# EAGLE design mux-board (EAGLE 8.5.1)

## Sheet 1 of 2
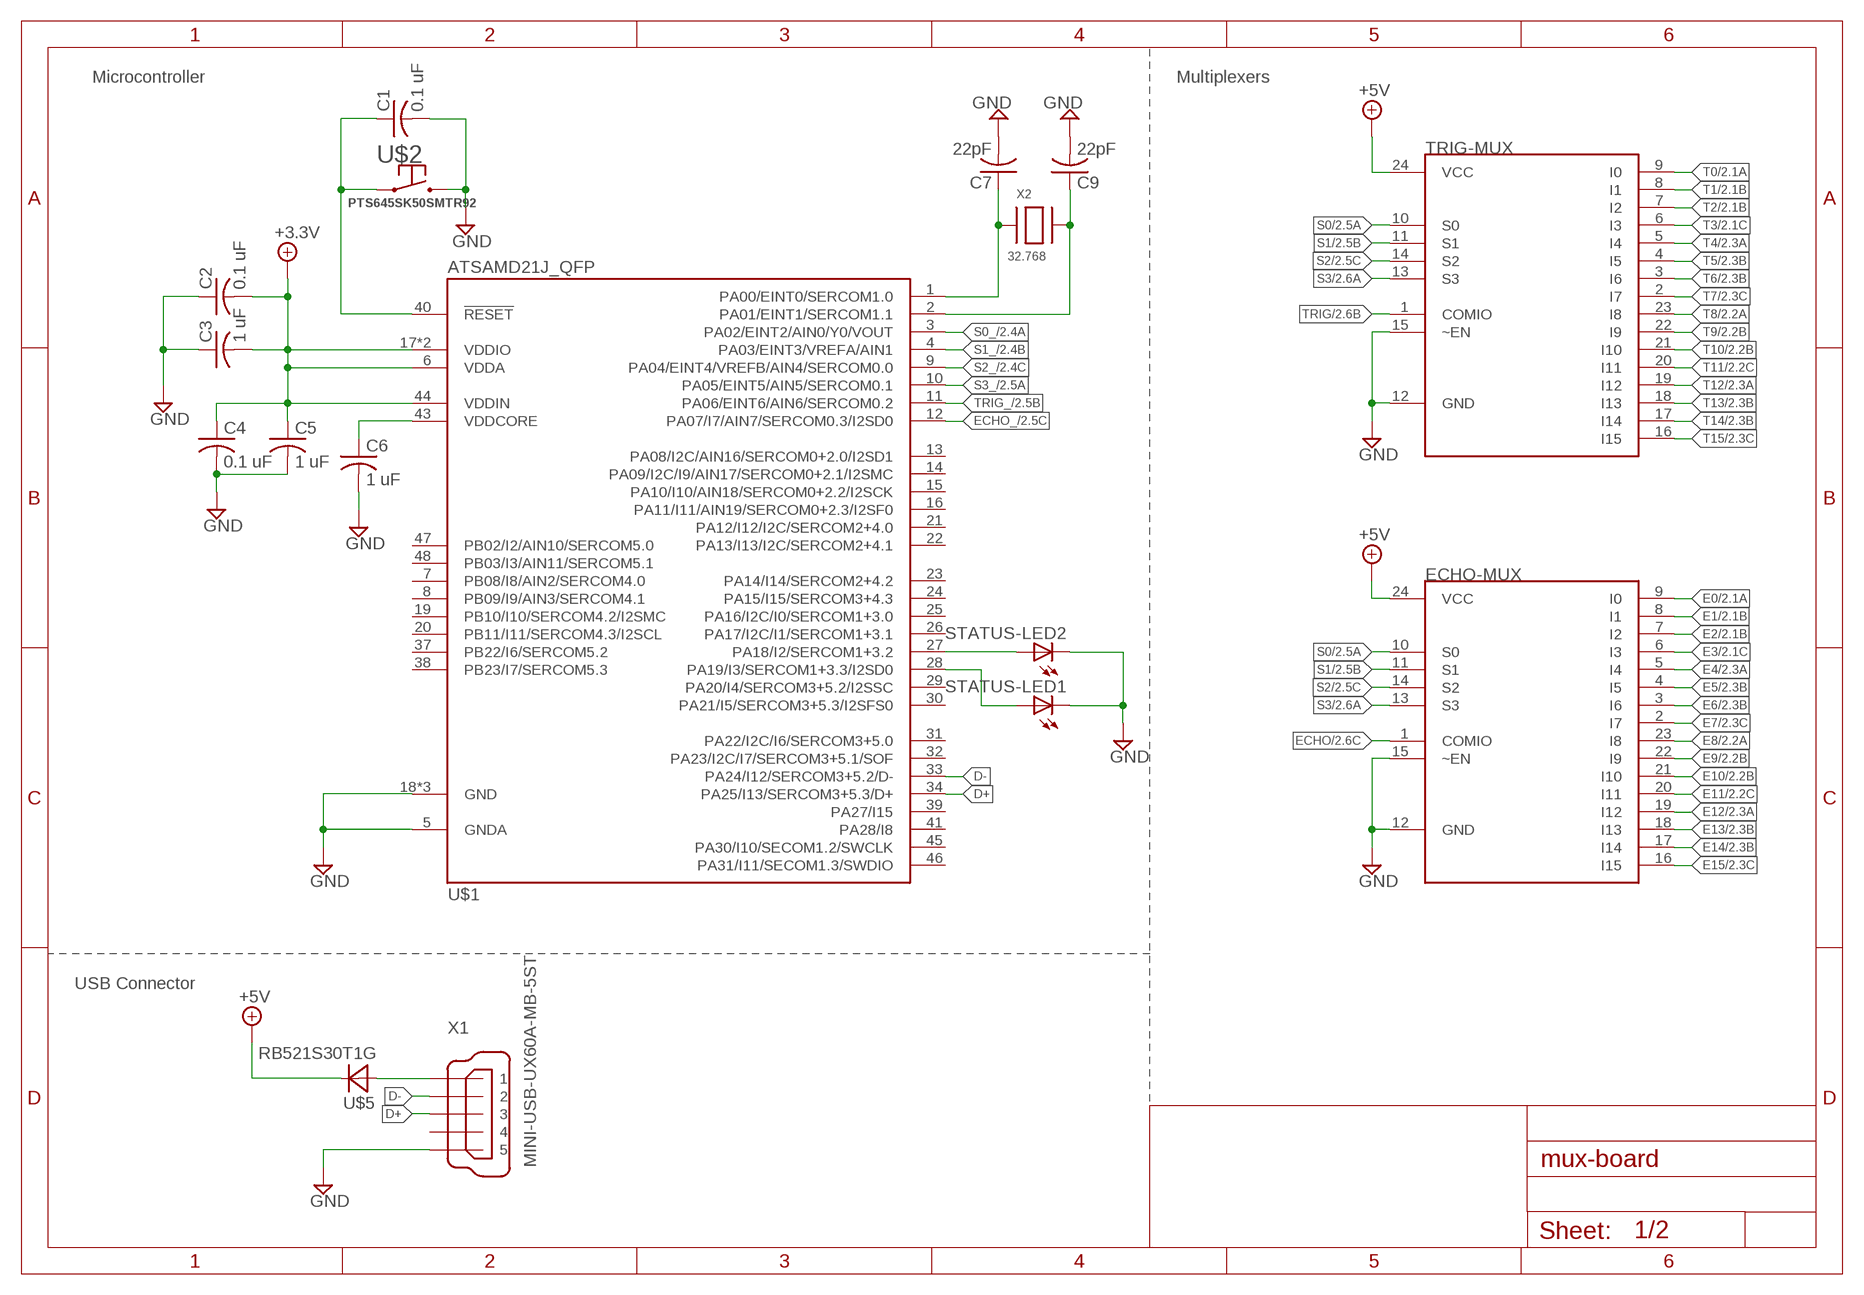
[diagram p0: schematic, sheet 1]

### Parts
C1  0.1 uF  C-USC0603  [C0603]
C2  0.1 uF  C-USC0603  [C0603]
C3  1 uF  C-USC0603  [C0603]
C4  0.1 uF  C-USC0603  [C0603]
C5  1 uF  C-USC0603  [C0603]
C6  1 uF  C-USC0603  [C0603]
C7  22pF  C-USC0603  [C0603]
C9  22pF  C-USC0603  [C0603]
ECHO-MUX  CD74HC4067  [SO24R]
STATUS-LED1  LEDSML0603  [SML0603]
STATUS-LED2  LEDSML0603  [SML0603]
TRIG-MUX  CD74HC4067  [SO24R]
U$1  ATSAMD21J_QFP  [TQFP48_7MM]
U$2  PTS645SK50SMTR92  [PTS645SK50SMTR92]
U$5  RB521S30T1G  [SOD523]
X1  MINI-USB-UX60A-MB-5ST  [UX60A-MB-5ST]
X2  32.768  XTAL-3.2X1.5  [XTAL3215]

### Nets
+3.3V: C2.2 C3.2 C4.1 C5.1 U$1.6(VDDA) U$1.17(VDDIO) U$1.36(VDDIO) U$1.44(VDDIN) ; also sheet 2
+5V: ECHO-MUX.24(VCC) TRIG-MUX.24(VCC) U$5.C ; also sheet 2
D+: U$1.34(PA25/I13/SERCOM3+5.3/D+) X1.3
D-: U$1.33(PA24/I12/SERCOM3+5.2/D-) X1.2
E0: ECHO-MUX.9(I0) ; also sheet 2
E1: ECHO-MUX.8(I1) ; also sheet 2
E2: ECHO-MUX.7(I2) ; also sheet 2
E3: ECHO-MUX.6(I3) ; also sheet 2
E4: ECHO-MUX.5(I4) ; also sheet 2
E5: ECHO-MUX.4(I5) ; also sheet 2
E6: ECHO-MUX.3(I6) ; also sheet 2
E7: ECHO-MUX.2(I7) ; also sheet 2
E8: ECHO-MUX.23(I8) ; also sheet 2
E9: ECHO-MUX.22(I9) ; also sheet 2
E10: ECHO-MUX.21(I10) ; also sheet 2
E11: ECHO-MUX.20(I11) ; also sheet 2
E12: ECHO-MUX.19(I12) ; also sheet 2
E13: ECHO-MUX.18(I13) ; also sheet 2
E14: ECHO-MUX.17(I14) ; also sheet 2
E15: ECHO-MUX.16(I15) ; also sheet 2
ECHO: ECHO-MUX.1(COMIO) ; also sheet 2
ECHO_: U$1.12(PA07/I7/AIN7/SERCOM0.3/I2SD0) ; also sheet 2
GND: C1.2 C2.1 C3.1 C4.2 C5.2 C6.2 C7.2 C9.2 ECHO-MUX.12(GND) ECHO-MUX.15(~EN) STATUS-LED1.C STATUS-LED2.C TRIG-MUX.12(GND) TRIG-MUX.15(~EN) U$1.5(GNDA) U$1.18(GND) U$1.35(GND) U$1.42(GND) U$2.3 U$2.4 X1.5 ; also sheet 2
N$1: C6.1 U$1.43(VDDCORE)
N$2: C1.1 U$1.40(!RESET) U$2.1 U$2.2
N$3: STATUS-LED1.A U$1.28(PA19/I3/SERCOM1+3.3/I2SD0)
N$4: U$5.A X1.1
N$5: STATUS-LED2.A U$1.27(PA18/I2/SERCOM1+3.2)
S0: ECHO-MUX.10(S0) TRIG-MUX.10(S0) ; also sheet 2
S0_: U$1.3(PA02/EINT2/AIN0/Y0/VOUT) ; also sheet 2
S1: ECHO-MUX.11(S1) TRIG-MUX.11(S1) ; also sheet 2
S1_: U$1.4(PA03/EINT3/VREFA/AIN1) ; also sheet 2
S2: ECHO-MUX.14(S2) TRIG-MUX.14(S2) ; also sheet 2
S2_: U$1.9(PA04/EINT4/VREFB/AIN4/SERCOM0.0) ; also sheet 2
S3: ECHO-MUX.13(S3) TRIG-MUX.13(S3) ; also sheet 2
S3_: U$1.10(PA05/EINT5/AIN5/SERCOM0.1) ; also sheet 2
T0: TRIG-MUX.9(I0) ; also sheet 2
T1: TRIG-MUX.8(I1) ; also sheet 2
T2: TRIG-MUX.7(I2) ; also sheet 2
T3: TRIG-MUX.6(I3) ; also sheet 2
T4: TRIG-MUX.5(I4) ; also sheet 2
T5: TRIG-MUX.4(I5) ; also sheet 2
T6: TRIG-MUX.3(I6) ; also sheet 2
T7: TRIG-MUX.2(I7) ; also sheet 2
T8: TRIG-MUX.23(I8) ; also sheet 2
T9: TRIG-MUX.22(I9) ; also sheet 2
T10: TRIG-MUX.21(I10) ; also sheet 2
T11: TRIG-MUX.20(I11) ; also sheet 2
T12: TRIG-MUX.19(I12) ; also sheet 2
T13: TRIG-MUX.18(I13) ; also sheet 2
T14: TRIG-MUX.17(I14) ; also sheet 2
T15: TRIG-MUX.16(I15) ; also sheet 2
TRIG: TRIG-MUX.1(COMIO) ; also sheet 2
TRIG_: U$1.11(PA06/EINT6/AIN6/SERCOM0.2) ; also sheet 2
X3-1: C7.1 U$1.1(PA00/EINT0/SERCOM1.0) X2.P$1
X3-2: C9.1 U$1.2(PA01/EINT1/SERCOM1.1) X2.P$2
Unconnected: U$1.7(PB08/I8/AIN2/SERCOM4.0) U$1.8(PB09/I9/AIN3/SERCOM4.1) U$1.13(PA08/I2C/AIN16/SERCOM0+2.0/I2SD1) U$1.14(PA09/I2C/I9/AIN17/SERCOM0+2.1/I2SMC) U$1.15(PA10/I10/AIN18/SERCOM0+2.2/I2SCK) U$1.16(PA11/I11/AIN19/SERCOM0+2.3/I2SF0) U$1.19(PB10/I10/SERCOM4.2/I2SMC) U$1.20(PB11/I11/SERCOM4.3/I2SCL) U$1.21(PA12/I12/I2C/SERCOM2+4.0) U$1.22(PA13/I13/I2C/SERCOM2+4.1) U$1.23(PA14/I14/SERCOM2+4.2) U$1.24(PA15/I15/SERCOM3+4.3) U$1.25(PA16/I2C/I0/SERCOM1+3.0) U$1.26(PA17/I2C/I1/SERCOM1+3.1) U$1.29(PA20/I4/SERCOM3+5.2/I2SSC) U$1.30(PA21/I5/SERCOM3+5.3/I2SFS0) U$1.31(PA22/I2C/I6/SERCOM3+5.0) U$1.32(PA23/I2C/I7/SERCOM3+5.1/SOF) U$1.37(PB22/I6/SERCOM5.2) U$1.38(PB23/I7/SERCOM5.3) U$1.39(PA27/I15) U$1.41(PA28/I8) U$1.45(PA30/I10/SECOM1.2/SWCLK) U$1.46(PA31/I11/SECOM1.3/SWDIO) U$1.47(PB02/I2/AIN10/SERCOM5.0) U$1.48(PB03/I3/AIN11/SERCOM5.1) X1.4

### Notes on the sheet
- Microcontroller | Multiplexers
- USB Connector

## Sheet 2 of 2
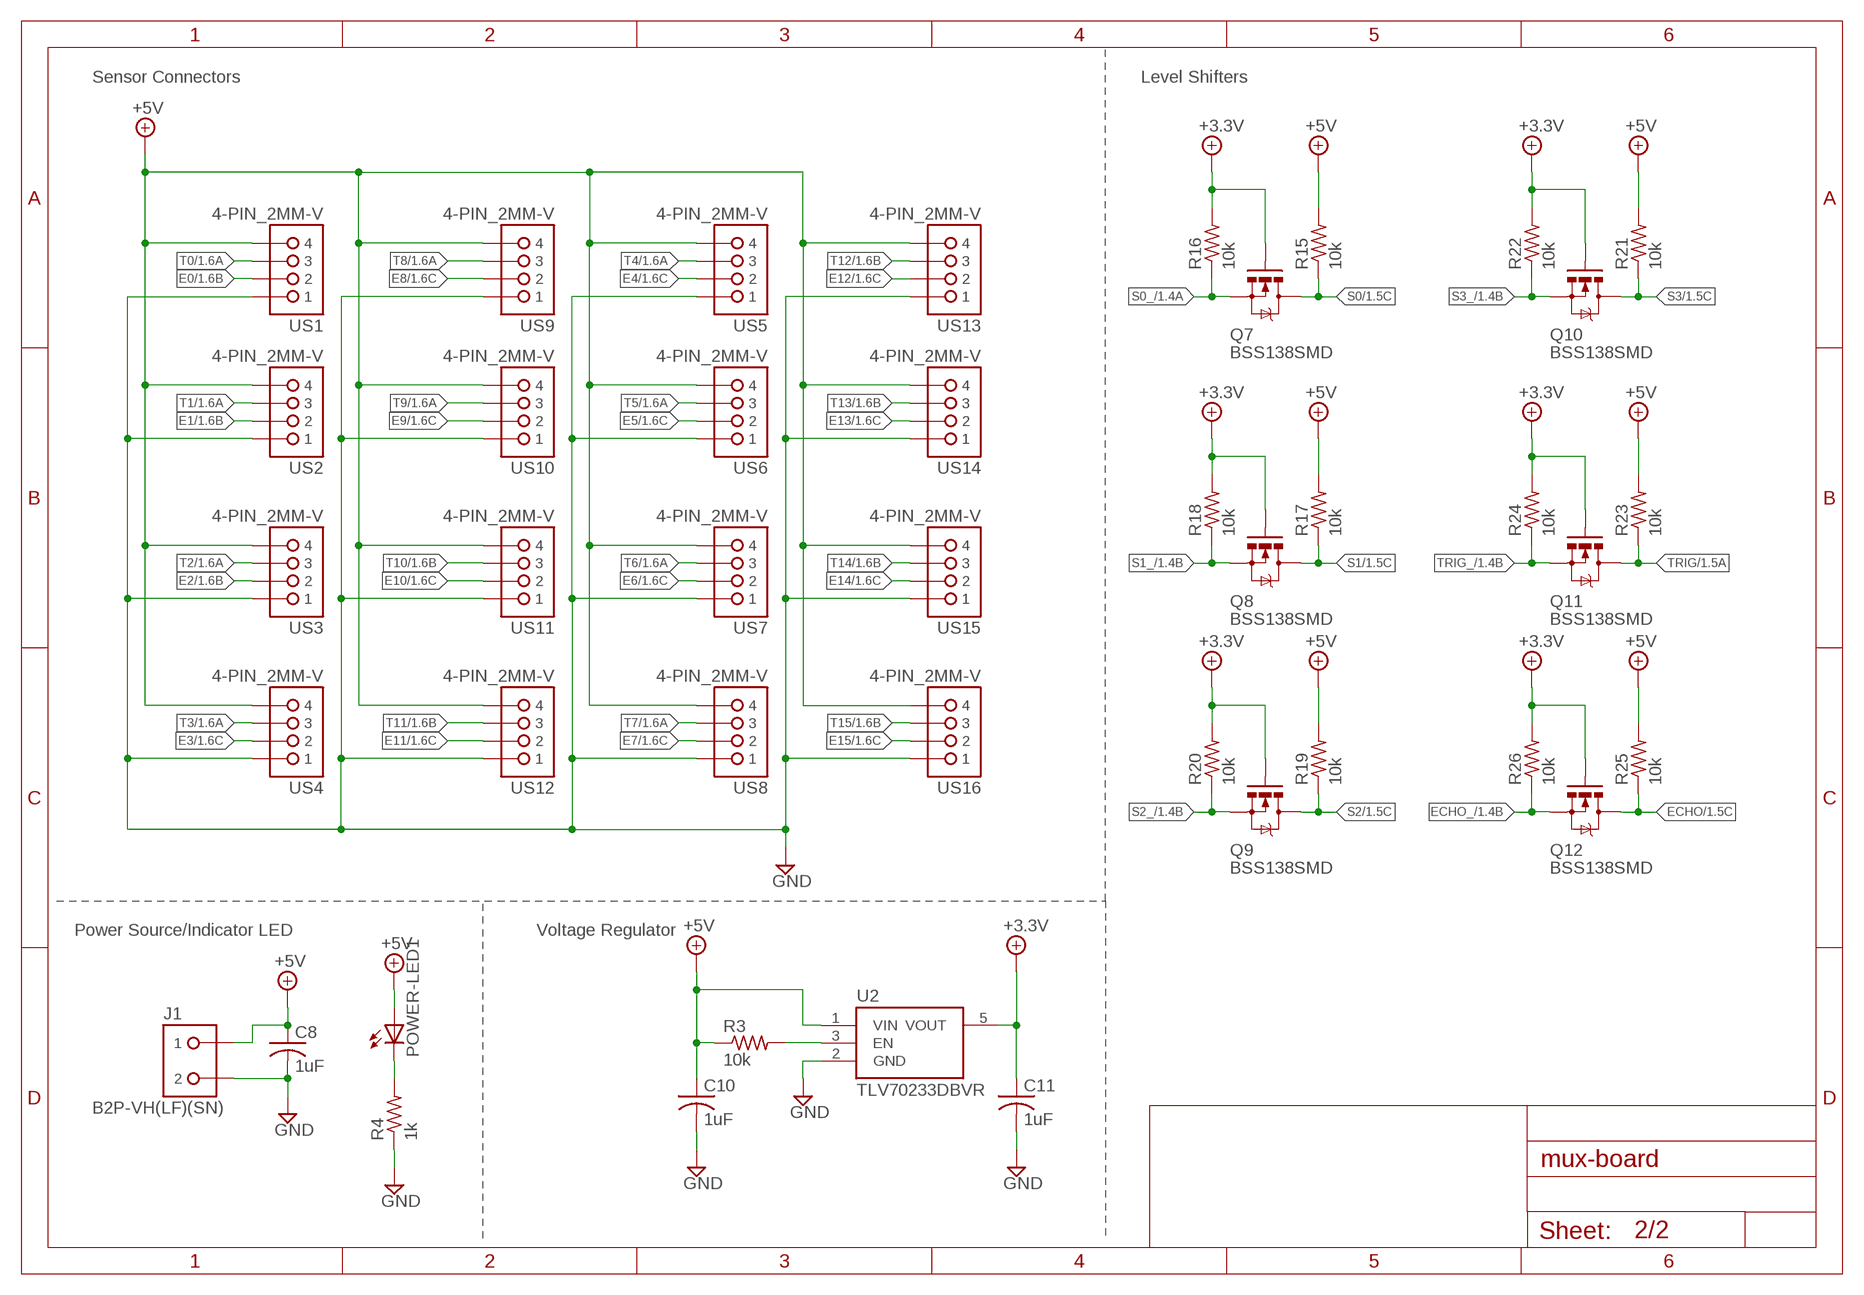
[diagram p1: schematic, sheet 2]

### Parts
C8  1uF  C-USC0603  [C0603]
C10  1uF  C-USC0603  [C0603]
C11  1uF  C-USC0603  [C0603]
J1  B2P-VH(LF)(SN)  [B2P]
POWER-LED1  LEDSML0603  [SML0603]
Q7  BSS138SMD  [SPARKFUN_SOT23-3]
Q8  BSS138SMD  [SPARKFUN_SOT23-3]
Q9  BSS138SMD  [SPARKFUN_SOT23-3]
Q10  BSS138SMD  [SPARKFUN_SOT23-3]
Q11  BSS138SMD  [SPARKFUN_SOT23-3]
Q12  BSS138SMD  [SPARKFUN_SOT23-3]
R3  10k  R-US_R0603  [R0603]
R4  1k  R-US_R0603  [R0603]
R15  10k  R-US_R0603  [R0603]
R16  10k  R-US_R0603  [R0603]
R17  10k  R-US_R0603  [R0603]
R18  10k  R-US_R0603  [R0603]
R19  10k  R-US_R0603  [R0603]
R20  10k  R-US_R0603  [R0603]
R21  10k  R-US_R0603  [R0603]
R22  10k  R-US_R0603  [R0603]
R23  10k  R-US_R0603  [R0603]
R24  10k  R-US_R0603  [R0603]
R25  10k  R-US_R0603  [R0603]
R26  10k  R-US_R0603  [R0603]
U2  TLV70233DBVR  [SOT-23-5]
US1  4-PIN_2MM-V  [2MM-4-V]
US2  4-PIN_2MM-V  [2MM-4-V]
US3  4-PIN_2MM-V  [2MM-4-V]
US4  4-PIN_2MM-V  [2MM-4-V]
US5  4-PIN_2MM-V  [2MM-4-V]
US6  4-PIN_2MM-V  [2MM-4-V]
US7  4-PIN_2MM-V  [2MM-4-V]
US8  4-PIN_2MM-V  [2MM-4-V]
US9  4-PIN_2MM-V  [2MM-4-V]
US10  4-PIN_2MM-V  [2MM-4-V]
US11  4-PIN_2MM-V  [2MM-4-V]
US12  4-PIN_2MM-V  [2MM-4-V]
US13  4-PIN_2MM-V  [2MM-4-V]
US14  4-PIN_2MM-V  [2MM-4-V]
US15  4-PIN_2MM-V  [2MM-4-V]
US16  4-PIN_2MM-V  [2MM-4-V]

### Nets
+3.3V: C11.1 Q7.1(G) Q8.1(G) Q9.1(G) Q10.1(G) Q11.1(G) Q12.1(G) R16.2 R18.2 R20.2 R22.2 R24.2 R26.2 U2.5(VOUT) ; also sheet 1
+5V: C8.1 C10.1 J1.1 POWER-LED1.A R3.1 R15.2 R17.2 R19.2 R21.2 R23.2 R25.2 U2.1(VIN) US1.4 US2.4 US3.4 US4.4 US5.4 US6.4 US7.4 US8.4 US9.4 US10.4 US11.4 US12.4 US13.4 US14.4 US15.4 US16.4 ; also sheet 1
E0: US1.2 ; also sheet 1
E1: US2.2 ; also sheet 1
E2: US3.2 ; also sheet 1
E3: US4.2 ; also sheet 1
E4: US5.2 ; also sheet 1
E5: US6.2 ; also sheet 1
E6: US7.2 ; also sheet 1
E7: US8.2 ; also sheet 1
E8: US9.2 ; also sheet 1
E9: US10.2 ; also sheet 1
E10: US11.2 ; also sheet 1
E11: US12.2 ; also sheet 1
E12: US13.2 ; also sheet 1
E13: US14.2 ; also sheet 1
E14: US15.2 ; also sheet 1
E15: US16.2 ; also sheet 1
ECHO: Q12.3(D) R25.1 ; also sheet 1
ECHO_: Q12.2(S) R26.1 ; also sheet 1
GND: C8.2 C10.2 C11.2 J1.2 R4.1 U2.2(GND) US1.1 US2.1 US3.1 US4.1 US5.1 US6.1 US7.1 US8.1 US9.1 US10.1 US11.1 US12.1 US13.1 US14.1 US15.1 US16.1 ; also sheet 1
N$10: R3.2 U2.3(EN)
N$11: POWER-LED1.C R4.2
S0: Q7.3(D) R15.1 ; also sheet 1
S0_: Q7.2(S) R16.1 ; also sheet 1
S1: Q8.3(D) R17.1 ; also sheet 1
S1_: Q8.2(S) R18.1 ; also sheet 1
S2: Q9.3(D) R19.1 ; also sheet 1
S2_: Q9.2(S) R20.1 ; also sheet 1
S3: Q10.3(D) R21.1 ; also sheet 1
S3_: Q10.2(S) R22.1 ; also sheet 1
T0: US1.3 ; also sheet 1
T1: US2.3 ; also sheet 1
T2: US3.3 ; also sheet 1
T3: US4.3 ; also sheet 1
T4: US5.3 ; also sheet 1
T5: US6.3 ; also sheet 1
T6: US7.3 ; also sheet 1
T7: US8.3 ; also sheet 1
T8: US9.3 ; also sheet 1
T9: US10.3 ; also sheet 1
T10: US11.3 ; also sheet 1
T11: US12.3 ; also sheet 1
T12: US13.3 ; also sheet 1
T13: US14.3 ; also sheet 1
T14: US15.3 ; also sheet 1
T15: US16.3 ; also sheet 1
TRIG: Q11.3(D) R23.1 ; also sheet 1
TRIG_: Q11.2(S) R24.1 ; also sheet 1

### Notes on the sheet
- Sensor Connectors | Level Shifters
- Power Source/Indicator LED | Voltage Regulator

## Library data of the parts
C1-C6 = resistor:C-US: CAPACITOR, American symbol
C7-C11 = rcl:C-US: CAPACITOR, American symbol
ECHO-MUX TRIG-MUX = mux-board:CD74HC4067
J1 = RoboJackets-Connectors:B2P?-VH(LF)(SN): Power Connector Brand: JST Sales America Inc. <https://www.jst.com/> Series: VH <http://www.digikey.com/product-search/en?FV=fff40016,fff802f3,ffec0e9d> Distributor: Digi-Key <http://www.digikey.com/product-detail/en/B2PS-VH%28LF%29%28SN%29/455-1648-ND/926555>; PINS: 2; PIN_PITCH: 3.96 mm
POWER-LED1 STATUS-LED1 STATUS-LED2 = card:LED: LED OSRAM: - CHIPLED LG R971, LG N971, LY N971, LG Q971, LY Q971, LO R971, LY R971 LH N974, LH R974 LS Q976, LO Q976, LY Q976 LO Q996 - Hyper CHIPLED LW Q18S LB Q993, LB Q99A, LB R99A - SideLED LS A670, LO A670, LY A670, LG A670, LP A670 LB A673, LV A673, LT A673, LW A673 LH A674 LY A675 LS A676, LA A676, LO A676, LY A676, LW A676 LS A679, LY A679, LG A679 - Hyper Micro SIDELED® LS Y876, LA Y876, LO Y876, LY Y876 LT Y87S - SmartLED LW L88C, LW L88S LB L89C, LB L89S, LG L890 LS L89K, LO L89K, LY L89K LS L896, LA L896, LO L896, LY L896 - TOPLED LS T670, LO T670, LY T670, LG T670, LP T670 LSG T670, LSP T670, LSY T670, LOP T670, LYG T670 LG T671, LOG T671, LSG T671 LB T673, LV T673, LT T673, LW T673 LH T674 LS T676, LA T676, LO T676, LY T676, LB T676, LH T676, LSB T676, LW T676 LB T67C, LV T67C, LT T67C, LS T67K, LO T67K, LY T67K, LW E67C LS E67B, LA E67B, LO E67B, LY E67B, LB E67C, LV E67C, LT E67C LW T67C LS T679, LY T679, LG T679 LS T770, LO T770, LY T770, LG T770, LP T770 LB T773, LV T773, LT T773, LW T773 LH T774 LS E675, LA E675, LY E675, LS T675 LS T776, LA T776, LO T776, LY T776, LB T776 LHGB T686 LT T68C, LB T68C - Hyper Mini TOPLED® LB M676 - Mini TOPLED Santana® LG M470 LS M47K, LO M47K, LY M47K Source: http://www.osram.convergy.de LUXEON: - LUMILED® LXK2-PW12-R00, LXK2-PW12-S00, LXK2-PW14-U00, LXK2-PW14-V00 LXK2-PM12-R00, LXK2-PM12-S00, LXK2-PM14-U00 LXK2-PE12-Q00, LXK2-PE12-R00, LXK2-PE12-S00, LXK2-PE14-T00, LXK2-PE14-U00 LXK2-PB12-K00, LXK2-PB12-L00, LXK2-PB12-M00, LXK2-PB14-N00, LXK2-PB14-P00, LXK2-PB14-Q00 LXK2-PR12-L00, LXK2-PR12-M00, LXK2-PR14-Q00, LXK2-PR14-R00 LXK2-PD12-Q00, LXK2-PD12-R00, LXK2-PD12-S00 LXK2-PH12-R00, LXK2-PH12-S00 LXK2-PL12-P00, LXK2-PL12-Q00, LXK2-PL12-R00 Source: www.luxeon.com KINGBRIGHT: KA-3528ASYC Source: www.kingbright.com
Q7-Q12 = Logic_Level_Bidirectional:BSS138
R3 R4 = resistor:R-US_: RESISTOR, American symbol
R15-R26 = rcl:R-US_: RESISTOR, American symbol; SPICEPREFIX: R
U2 = card:TLV70233; DIGIKEY: 296-32415-1-ND; MPN: TLV70233DBVR
U$1 = mux-board:ATSAMD21J
U$2 = card:PTS645SK50SMTR92
U$5 = mux-board:RB521S30T1G
US1-US16 = RoboJackets-Connectors:4-PIN_2MM-*: MPN: 0353630460; PINS: 4; PIN_PITCH: 2.0 mm
X1 = card:MINI-USB-: MINI USB Connector Source: http://www.hirose.co.jp/cataloge_hp/e24000019.pdf; OC_FARNELL: unknown; OC_NEWARK: unknown
X2 = lib-card:XTAL: Low cost SMT crystals, no capacitors included http://www.ladyada.net/library/eagle

## Board
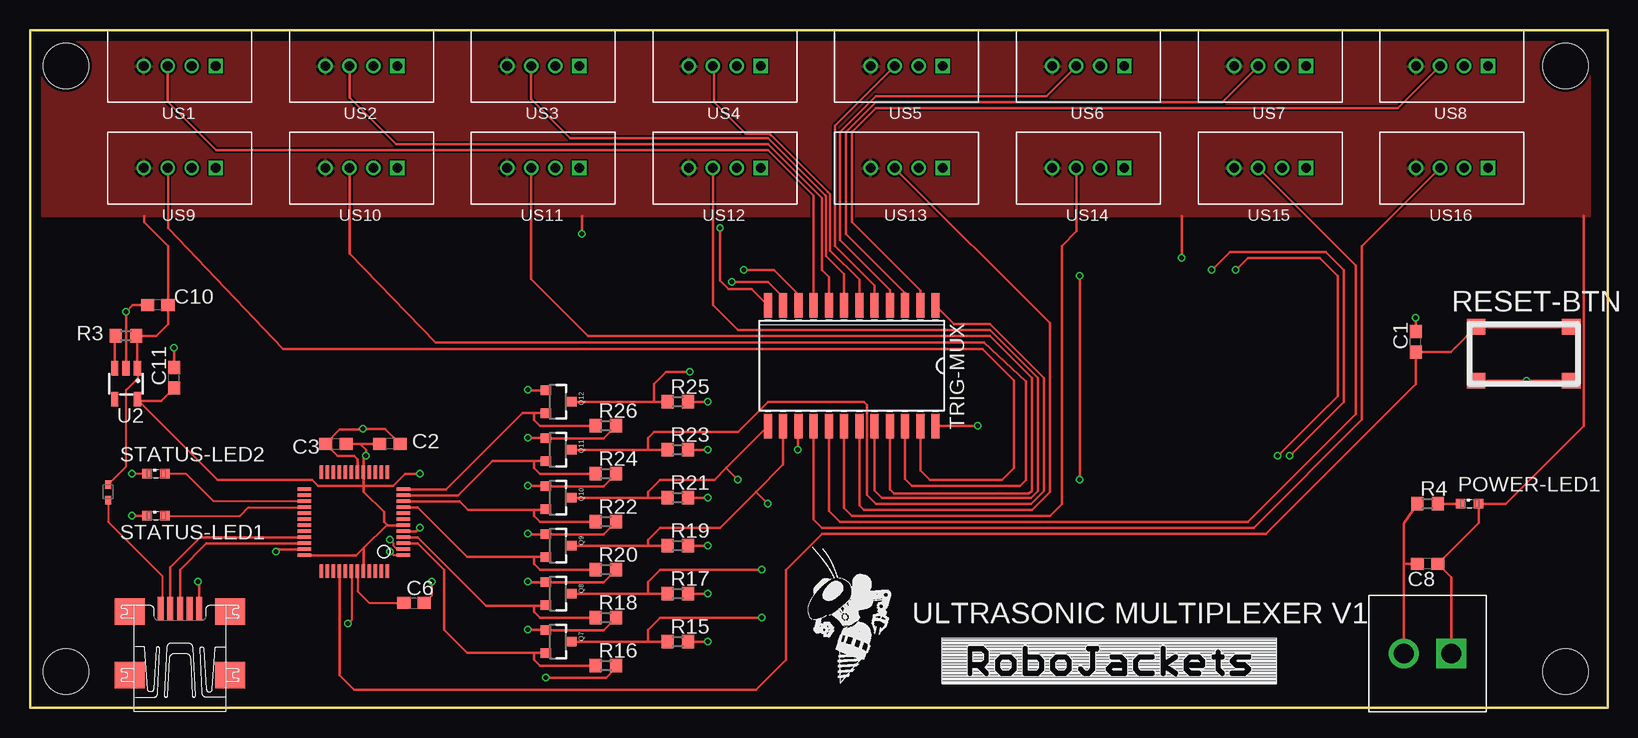
[diagram p2: board, top side]
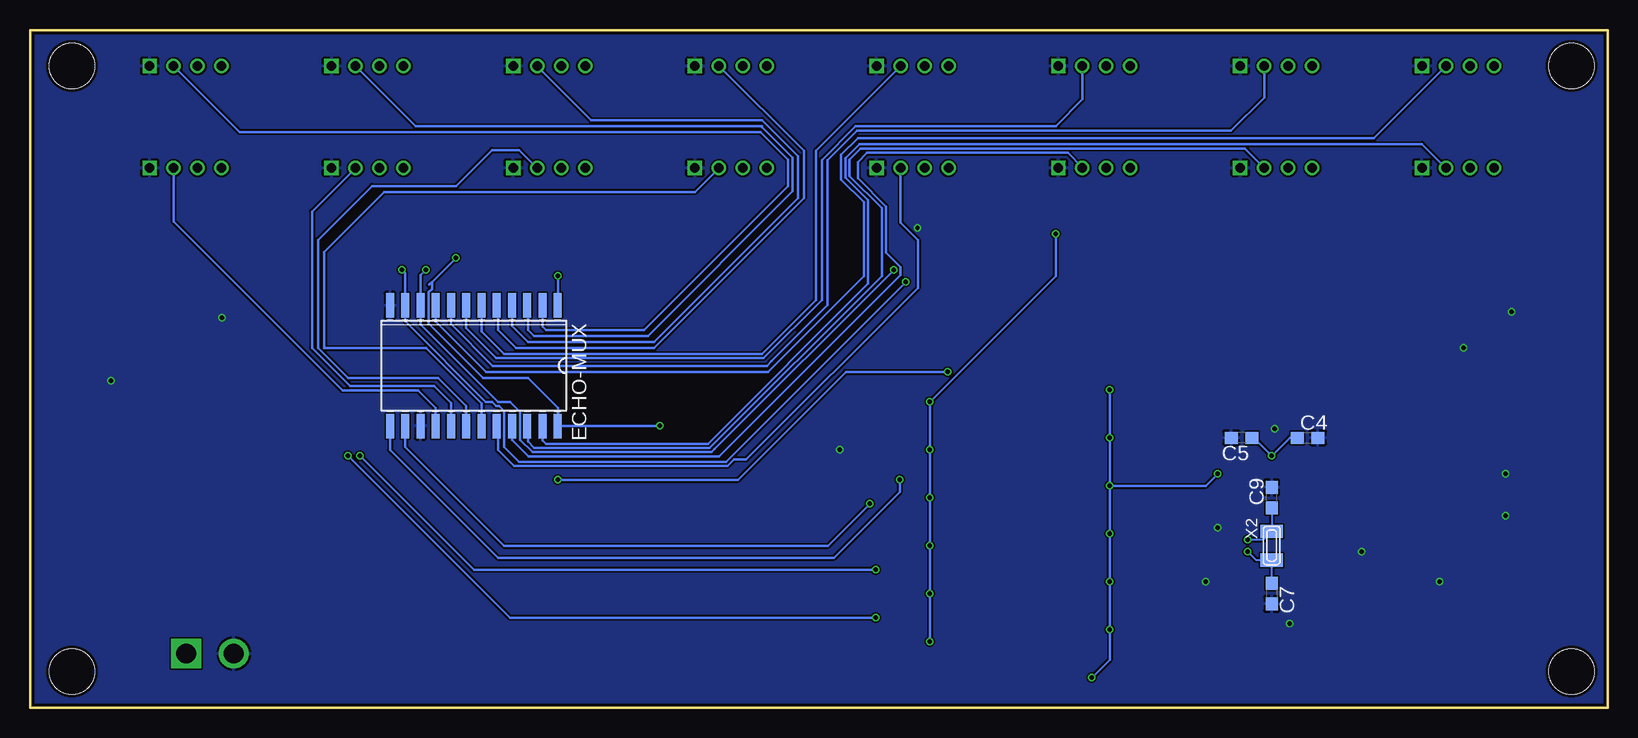
[diagram p3: board, bottom side, seen from below]

Size 131.5 x 56.5 mm. Coordinates in mm from the lower left corner, seen from the top.
Outline: 0,0 131.5,0 131.5,56.5 0,56.5 0,0
Copper layers (1*16): Top 0.018mm / dielectric 1.55mm / Bottom 0.018mm
Design rules "eC_2Layer_PClass6_BaseCopperO18_eCDefault": minimum track width 0.15mm, minimum drill 0.35mm, track to track 0.15mm, track to pad 0.15mm, pad to pad 0.15mm, via to via 0.15mm, smd to smd 0mil, copper to edge 0.25mm, drill to drill 0.35mm, minimum pad ring 0.175mm, minimum via ring 0.125mm, stop-mask expansion 0mil, vias tented up to drill 0.45mm, thermal gap 0.2mm
Holes 3.8 mm at 3,53.5 128,53.5 3,3 128,3

### Footprints (pad centres in the part's own frame; a part is rotated, then mirrored left to right if it is on the bottom)
C0603 = smd 1.1 x 1: 1 -0.85,0; 2 0.85,0
SO24R = smd 0.66 x 2.032: 1 -6.985,-5.029; 2 -5.715,-5.029; 3 -4.445,-5.029; 4 -3.175,-5.029; 5 -1.905,-5.029; 6 -0.635,-5.029; 7 0.635,-5.029; 8 1.905,-5.029; 9 3.175,-5.029; 10 4.445,-5.029; 11 5.715,-5.029; 12 6.985,-5.029; 13 6.985,5.029; 14 5.715,5.029; 15 4.445,5.029; 16 3.175,5.029; 17 1.905,5.029; 18 0.635,5.029; 19 -0.635,5.029; 20 -1.905,5.029; 21 -3.175,5.029; 22 -4.445,5.029; 23 -5.715,5.029; 24 -6.985,5.029
B2P = drill 1.65 square: 1 0.02,0 | drill 1.65: 2 3.98,0
SML0603 = smd 0.8 x 0.8: A 0.75,0; C -0.75,0
SPARKFUN_SOT23-3 = smd 0.8 x 0.9: 1 -0.95,-1; 2 0.95,-1; 3 0,1.1
R0603 = smd 1 x 1.1: 1 -0.85,0; 2 0.85,0
SOT-23-5 = smd 0.6 x 1.2: 1 -0.95,-1.306; 2 0,-1.306; 3 0.95,-1.306; 4 0.95,1.306; 5 -0.95,1.306
TQFP48_7MM = smd 1.13 x 0.29: 1 -4.115,2.795; 2 -4.115,2.295; 3 -4.115,1.795; 4 -4.115,1.295; 5 -4.115,0.795; 6 -4.115,0.295; 7 -4.115,-0.205; 8 -4.115,-0.705; 9 -4.115,-1.205; 10 -4.115,-1.705; 11 -4.115,-2.205; 12 -4.115,-2.705; 25 4.115,-2.705; 26 4.115,-2.205; 27 4.115,-1.705; 28 4.115,-1.205; 29 4.115,-0.705; 30 4.115,-0.205; 31 4.115,0.295; 32 4.115,0.795; 33 4.115,1.295; 34 4.115,1.795; 35 4.115,2.295; 36 4.115,2.795 | smd 0.29 x 1.13: 13 -2.795,-4.115; 14 -2.295,-4.115; 15 -1.795,-4.115; 16 -1.295,-4.115; 17 -0.795,-4.115; 18 -0.295,-4.115; 19 0.205,-4.115; 20 0.705,-4.115; 21 1.205,-4.115; 22 1.705,-4.115; 23 2.205,-4.115; 24 2.705,-4.115; 37 2.705,4.115; 38 2.205,4.115; 39 1.705,4.115; 40 1.205,4.115; 41 0.705,4.115; 42 0.205,4.115; 43 -0.295,4.115; 44 -0.795,4.115; 45 -1.295,4.115; 46 -1.795,4.115; 47 -2.295,4.115; 48 -2.795,4.115
PTS645SK50SMTR92 = smd 1.55 x 1.3: 1 -3.975,2.25; 2 3.975,2.25; 3 -3.975,-2.25; 4 3.975,-2.25
SOD523 = smd 0.7 x 0.5: A 0.7,0; C -0.6,0
2MM-4-V = drill 0.8 square: 1 -2,0 | drill 0.8: 2 0,0; 3 2,0; 4 4,0
UX60A-MB-5ST = smd 2 x 0.5: 1 2.25,1.6; 2 2.25,0.8; 3 2.25,0; 4 2.25,-0.8; 5 2.25,-1.6 | smd 2.2 x 2.5: M1 -3.3,-4.2; M2 -3.3,4.2; M3 2,4.2; M4 2,-4.2
XTAL3215 = smd 1.1 x 1.9: P$1 1.2,0; P$2 -1.2,0

### Placement (x,y rotation side)
C1  115.5,30.5 90 top
C2  30,22 180 top
C3  25.5,22 0 top
C4  25,22.5 0 bottom
C5  30.5,22.5 180 bottom
C6  32.01,8.71 0 top
C7  28,9.5 270 bottom
C8  116.5,12 180 top
C9  28,17.5 90 bottom
C10  10.65,33.56 180 top
C11  12,27.5 90 top
ECHO-MUX  94.5,28.5 180 bottom
J1  118.5,4.5 180 top
POWER-LED1  120,17 0 top
Q7  44,5.5 270 top
Q8  44,9.5 270 top
Q9  44,13.5 270 top
Q10  44,17.5 270 top
Q11  44,21.5 270 top
Q12  44,25.5 270 top
R3  8,31 180 top
R4  116.5,17 0 top
R15  54,5.5 0 top
R16  48,3.5 0 top
R17  54,9.5 0 top
R18  48,7.5 0 top
R19  54,13.5 0 top
R20  48,11.5 0 top
R21  54,17.5 0 top
R22  48,15.5 0 top
R23  54,21.5 0 top
R24  48,19.5 0 top
R25  54,25.5 0 top
R26  48,23.5 0 top
STATUS-LED1  10.5,16 0 top
STATUS-LED2  10.5,19.5 0 top
TRIG-MUX  68.5,28.5 180 top
U2  8,27 180 top
U$1  27,15.5 180 top
U$2  124.5,29.5 0 top
U$3  [ROBOBUZZ_0.6X]  67.5,2 0 top
U$4  [ROBOJACKETS]  76,2 0 top
U$5  6.5,18 270 top
US1  13.47,53.5 180 top
US2  28.62,53.5 180 top
US3  43.77,53.5 180 top
US4  58.92,53.5 180 top
US5  74.08,53.5 180 top
US6  89.22,53.5 180 top
US7  104.38,53.5 180 top
US8  119.53,53.5 180 top
US9  13.47,45 180 top
US10  28.62,45 180 top
US11  43.77,45 180 top
US12  58.92,45 180 top
US13  74.08,45 180 top
US14  89.22,45 180 top
US15  104.38,45 180 top
US16  119.53,45 180 top
X1  12.5,6 90 top
X2  28,13.5 270 bottom

### Tracks (layer width: path | path; a pad name or v marks a point on that pad's centre or on a via)
+3.3V  (via drill 0.35)
  Top 0.2: R18.2 47.8,6.45 Q7.1 42.95,6.5 v41.5,6.5 | R20.2 47.8,10.45 Q8.1 41.55,10.45 v41.5,10.5 | R22.2 47.8,14.45 Q9.1 41.55,14.45 v41.5,14.5 | R24.2 47.8,18.45 Q10.1 42.95,18.5 v41.5,18.5 | R26.2 47.8,22.45 Q11.1 42.95,22.5 v41.5,22.5 | 27.8,17.99 27.8,18 | 27.8,18 27.8,18.5 | 27.8,18.5 U$1.17 27.8,20.8 v28,21 28,21.5 27.5,22 | C2.2 27.5,22 | 27.5,22 C3.2 | U2.5 9.07,25.57 | 9.07,25.57 15.64,19 23.5,19 24,18.5 27.8,18.5 | C11.1 10.92,25.57 9.07,25.57 | v32.5,19.5 31.25,19.5 30.25,18.5 27.8,18.5 | v43,2.5 48,2.5 48.85,3.35 R16.2 | v41.5,26.5 41.55,26.45 Q12.1 | 27.8,18 29.5,16.3 29.5,15.5 29.75,15.25 | 29.75,15.25 29.8,15.21 U$1.6 | 29.75,15.25 27.8,13.29 | 27.8,13.29 U$1.44 | U$1.36 27.2,12.71 27.8,13.29
  Bottom 0.2: C5.1 29.5,22.5 v28,21 26.5,22.5 C4.1 | v41.5,18.5 v41.5,14.5 v41.5,10.5 v41.5,6.5 41.5,4 v43,2.5 | v41.5,18.5 33.5,18.5 v32.5,19.5 | v41.5,18.5 v41.5,22.5 v41.5,26.5
+5V  (via drill 0.35)
  Top 0.152: U$5.C 8,20.1 8,26.5 9,27.5 9,28.26 U2.1
  Top 0.2: U2.1 8.95,30.9 R3.1 10.5,31 11.5,32 C10.1 11.5,38.5 9.5,40.5 9.5,41 | R25.2 v56.5,25.5 | v56.5,21.5 R23.2 | v56.5,17.5 R21.2 | v56.5,13.5 R19.2 | v56.5,9.5 R17.2 | v56.5,5.5 R15.2 | v46,39.5 46,41 | v79,23.5 75.51,23.5 TRIG-MUX.24 | J1.1 118.48,10.87 C8.1 120.75,15.4 POWER-LED1.A 123,17 129.5,23.5 129.5,41 | v96,37.5 96,41
  Bottom 0.2: v56.5,5.5 v56.5,9.5 v56.5,13.5 v56.5,17.5 v56.5,21.5 v56.5,25.5 46,36 v46,39.5 | ECHO-MUX.24 87.49,23.5 | 87.49,23.5 v79,23.5 | 87.49,23.5 87.49,24.99 90,27.5 93.75,27.5 98.25,32.01 98.25,34.65 98,34.9 98,35.5 | 98.25,35.25 98,35.5 | 98,35.5 v96,37.5
  pour Top: 1,55.5 1,41 130,41 130,55.5
D+
  Top 0.2: X1.3 12.5,11.5 14.71,13.71 U$1.34
D-
  Top 0.2: U$1.33 14.21,14.21 11.7,11.7 X1.2
E0
  Bottom 0.2: ECHO-MUX.9 97.67,32.17 93.5,28 70,28 62,36 62,42.15 63.88,44.03 63.88,46.11 62.49,47.5 19.48,47.5 US1.2
E1
  Bottom 0.2: US2.2 28.62,50.88 31.39,48.11 62.55,48.11 65.02,45.63 65.02,33.55 69.68,28.89 70.07,28.5 92.93,28.5 96.41,31.97 ECHO-MUX.8
E2
  Bottom 0.2: US3.2 43.77,50.73 46,48.5 62.59,48.5 62.63,48.46 62.69,48.46 65.5,45.65 65.5,34 70.35,29.15 92.65,29.15 95.14,31.64 ECHO-MUX.7
E3
  Bottom 0.2: US4.2 66,46.42 66,34 70.5,29.5 92,29.5 93.86,31.36 ECHO-MUX.6
E4
  Bottom 0.2: ECHO-MUX.5 92.5,33.43 92.5,31.5 91,30 79.5,30 67,42.5 67,46.42 US5.2
E5
  Bottom 0.2: US6.2 84.72,49 70.5,49 67.5,46 67.5,42.5 79.5,30.5 90,30.5 91.33,31.82 ECHO-MUX.4
E6
  Bottom 0.2: ECHO-MUX.3 90,33.47 90,31.5 89.5,31 80,31 67.95,43.05 67.95,45.84 70.5,48.38 70.5,48.5 99.38,48.5 US7.2
E7
  Bottom 0.2: ECHO-MUX.2 88.78,31.79 88.5,31.5 80.31,31.5 68.31,43.5 68.31,45.7 70.61,48 114.03,48 US8.2
E8
  Bottom 0.2: ECHO-MUX.23 88.78,22.29 88.5,22 75,22 61.65,35.35 61.65,42.29 63.53,44.17 63.53,45.83 62.36,47 15.47,47 US9.2
E9
  Bottom 0.2: ECHO-MUX.22 90,23.42 90,22.18 89.47,21.65 74.85,21.65 60.5,36 60.5,41.64 63.18,44.32 63.18,45.68 62.25,46.61 30.23,46.61 US10.2
E10
  Bottom 0.2: ECHO-MUX.21 91.33,22.32 89.95,20.95 74.05,20.95 58.95,36.05 58.95,36.73 60.15,37.93 60.15,41.78 62.5,44.13 62.5,45.5 61.74,46.26 45,46.26 43.77,45.03 US11.2
E11
  Bottom 0.2: ECHO-MUX.20 92.5,23.38 92.5,21.5 91.15,20.15 73.36,20.15 72.81,20.7 71.81,20.7 57.5,35 57.5,39 58.92,40.42 US12.2
E12
  Bottom 0.2: US13.2 76.08,43 102,43 107,38 107,30 98.5,30 93.86,25.36 ECHO-MUX.19
E13
  Bottom 0.2: ECHO-MUX.18 95.14,25.14 97.5,27.5 105,27.5 107.5,30 107.5,39 103,43.5 96,43.5 93,46.5 90.72,46.5 US14.2
E14
  Bottom 0.2: US15.2 108,41.38 108,30 104.81,26.8 97.81,26.8 96.41,25.41 ECHO-MUX.17
E15
  Bottom 0.2: ECHO-MUX.16 97.67,25 99.13,26.45 105.45,26.45 119.53,40.52 US16.2
ECHO  (via drill 0.35)
  Top 0.2: Q12.3 52,25.5 | 52,25.5 R25.1 | v55,28 53,28 52,27 52,25.5 | v87.5,36 v87.5,19
  Bottom 0.2: ECHO-MUX.1 87.5,33.54 v87.5,36 | v87.5,19 72.5,19 63.5,28 v55,28
ECHO_
  Top 0.2: U$1.12 34.7,18.2 41.05,24.55 42,24.55 | 42,24.55 Q12.2 | R26.1 42.5,23.5 42,24 42,24.55
GND  (via drill 0.35)
  Top 0.152: STATUS-LED2.C v8.5,19.5 | U$1.42 26.8,7.29 v26.5,7 | C6.2 33.5,9.35 v33.5,10.5
  Top 0.2: J1.2 114.52,12 | 114.52,12 114.52,15.37 R4.1 | U$2.4 v124.75,27.25 U$2.3 | C1.2 v115.5,32.5 | TRIG-MUX.15 64,23.42 v64,21.5 | U$1.35 20.7,13.21 v20.5,13 | C2.1 29.6,23.25 v27.75,23.25 27.68,23.18 25.82,23.18 C3.1 | 24.91,22 C3.1 | U2.2 v8,33 8.56,33.56 C10.2 9.74,33.5 | C11.2 v12,30 | X1.5 14.1,10.4 v14,10.5 | U$1.5 32.2,14.71 v32.5,15 | TRIG-MUX.12 60.15,34.89 58.25,34.89 57.53,35.61 v57.53,40 | C8.2 114.52,12 | C3.1 25.65,21 27,21 27.3,20.7 U$1.18 | STATUS-LED1.C v8.5,16
  pour Bottom: 0,0 131.5,0 131.5,56.5 0,56.5
N$1
  Top 0.152: U$1.43 27.3,9.71 28.29,8.71 C6.1
N$2
  Top 0.2: U$2.2 U$2.1 118.42,29.65 C1.1 115.5,27 103,14.5 66,14.5 63,11.5 63,4 60.5,1.5 27,1.5 25.8,2.71 U$1.40
N$3
  Top 0.152: STATUS-LED1.A 17.5,16 18.2,16.7 U$1.28
N$4
  Top 0.152: U$5.A 6.5,15.5 11,11 11,8.35 X1.1
N$5
  Top 0.152: U$1.27 15.29,17.2 13,19.5 STATUS-LED2.A
N$10
  Top 0.2: U2.3 7.05,30.9 R3.2
N$11
  Top 0.2: R4.2 POWER-LED1.C
S0  (via drill 0.35)
  Top 0.2: v59.5,36.5 62,36.5 64.06,34.45 TRIG-MUX.10 | v98.5,36.5 100,38 108,38 109.5,36.5 109.5,25.5 v105,21 | v61,7.5 52.5,7.5 51.5,6.5 51.5,5.5 | 51.5,5.5 R15.1 | 51.5,5.5 Q7.3
  Bottom 0.2: v98.5,36.5 98.94,36.05 ECHO-MUX.10 98.94,31.95 92.5,25.5 91.5,25.5 90.64,24.64 90.64,22.32 89.62,21.3 74.7,21.3 74.43,21.57 v59.5,36.5 | v105,21 91.5,7.5 v61,7.5
S0_
  Top 0.2: U$1.3 32.3,13.71 34.5,11.5 34.5,6.5 36.45,4.55 42,4.55 | 42,4.55 Q7.2 | R16.1 42.5,3.5 42,4 42,4.55
S1  (via drill 0.35)
  Top 0.2: v58.5,35.5 61.5,35.5 62.78,34.22 TRIG-MUX.11 | v100.5,36.5 101.5,37.5 107.5,37.5 109,36 109,26 v104,21 | v61,11.5 52.5,11.5 51.5,10.5 51.5,9.5 | 51.5,9.5 R17.1 | Q8.3 51.5,9.5
  Bottom 0.2: v100.5,36.5 100.22,36.22 ECHO-MUX.11 100.22,32.21 93.5,25.5 93,25.5 92.64,25.15 92.4,25.15 92,24.75 92,21.75 90.75,20.5 73.5,20.5 v58.5,35.5 | v104,21 94.5,11.5 v61,11.5
S1_
  Top 0.2: U$1.4 32.3,14.21 38,8.5 42,8.5 | 42,8.5 42.95,8.5 Q8.2 | R18.1 42.5,7.5 42,8 42,8.5
S2  (via drill 0.35)
  Top 0.2: Q9.3 51.5,13.5 | 51.5,13.5 R19.1 | TRIG-MUX.14 62.78,20.29 60.5,18 | 60.5,18 57.5,15 52.5,15 51.5,14 51.5,13.5 | v61.5,17 60.5,18
  Bottom 0.2: ECHO-MUX.14 100.22,21.71 92,13.5 65,13.5 v61.5,17
S2_
  Top 0.2: U$1.9 32.3,16.7 36.45,12.55 42,12.55 | 42,12.55 Q9.2 | R20.1 42.5,11.5 42,12 42,12.55
S3  (via drill 0.35)
  Top 0.2: Q10.3 51.5,17.5 | 51.5,17.5 R21.1 | TRIG-MUX.13 58.02,19.98 | 58.02,19.98 57.04,19 52.5,19 51.5,18 51.5,17.5 | v59,19 58.02,19.98
  Bottom 0.2: ECHO-MUX.13 101.48,21.52 101.5,21.5 92.5,12.5 64.5,12.5 59,18 v59,19
S3_
  Top 0.2: U$1.10 35.8,17.2 36.5,16.5 42,16.5 | 42,16.5 42.95,16.5 Q10.2 | R22.1 42.5,15.5 42,16 42,16.5
T0
  Top 0.2: TRIG-MUX.9 65.33,42.67 61.5,46.5 15.5,46.5 11.47,50.52 US1.3
T1
  Top 0.2: US2.3 26.62,50.88 30.5,47 61.5,47 66,42.5 66,36.5 66.59,35.91 TRIG-MUX.8
T2
  Top 0.2: US3.3 41.77,50.73 45,47.5 61.5,47.5 66.25,42.75 66.25,42.74 66.35,42.65 66.35,37.65 67.86,36.13 TRIG-MUX.7 67.86,34.13
T3
  Top 0.2: 69.14,33.93 TRIG-MUX.6 69.14,35.67 66.7,38.1 66.7,42.8 66.5,42.99 66.5,43 61.75,47.75 | US4.3 57,53.42 57,50.5 59.65,47.85 61.65,47.85 61.74,47.75 61.75,47.75 | 61.7,47.8 61.75,47.75
T4
  Top 0.2: 70.41,34.09 TRIG-MUX.5 70.41,35.2 67.11,38.5 67.11,48.53 US5.3
T5
  Top 0.2: 71.67,33.83 TRIG-MUX.4 71.67,34.83 67.5,39 67.5,48 70.5,51 84.72,51 US6.3
T6
  Top 0.2: US7.3 99.38,50.5 70.5,50.5 68,48 68,39.5 72.94,34.55 TRIG-MUX.3 72.94,34.05
T7
  Top 0.2: US8.3 114.03,50 70.5,50 68.5,48 68.5,40.5 74.22,34.78 TRIG-MUX.2
T8
  Top 0.2: US9.3 11.5,44.98 11.5,40 21.12,29.88 79.38,29.88 82,27.26 82,20 81,19 75,19 74.22,19.79 TRIG-MUX.23
T9
  Top 0.2: US10.3 26.62,37.88 33.8,30.45 79.5,30.45 83,27.2 83,19 82.5,18.5 73.5,18.5 72.94,19.05 TRIG-MUX.22
T10
  Top 0.2: US11.3 41.77,35.73 46.5,31 80,31 83.5,27.5 83.5,18.06 83.29,17.85 72,17.85 71.67,18.18 TRIG-MUX.21
T11
  Top 0.2: US12.3 56.92,33.58 59,31.5 80,31.5 84,27.5 84,18.06 83.44,17.5 71,17.5 70.41,18.09 TRIG-MUX.20
T12
  Top 0.2: TRIG-MUX.19 69.14,16.86 69.5,16.5 83.5,16.5 85,18 85,32.08 US13.3
T13
  Top 0.2: TRIG-MUX.18 67.86,16.64 68.5,16 85,16 86,17 86,38.5 87.22,39.73 US14.3
T14
  Top 0.2: TRIG-MUX.17 66.59,16.41 67.5,15.5 101.5,15.5 110.5,24.5 110.5,36.88 US15.3
T15
  Top 0.2: TRIG-MUX.16 65.33,15.68 66,15 102,15 111.01,24.01 111.01,38.49 US16.3
TRIG
  Top 0.2: Q11.3 51.5,21.5 | 51.5,21.5 R23.1 | TRIG-MUX.1 77.01,32 80,32 84.5,27.5 84.5,18.07 83.43,17 70.5,17 69.75,17.75 69.75,25.25 69.5,25.5 61.5,25.5 59,23 52,23 51.5,22.5 51.5,21.5
TRIG_
  Top 0.2: U$1.11 35.7,17.7 38.55,20.55 42,20.55 | 42,20.55 Q11.2 | R24.1 42.5,19.5 42,20 42,20.55
X3-1  (via drill 0.35)
  Top 0.152: U$1.1 30.3,12.71 v30,13
  Bottom 0.152: C7.1 X2.P$1 29.3,12.3 v30,13
X3-2  (via drill 0.35)
  Top 0.152: v30,14 30.32,13.68 30.32,13.47 30.59,13.21 U$1.2
  Bottom 0.152: C9.1 X2.P$2 28.7,14 v30,14

### Text on the board
tNames: RESET-BTN
tSilk: ULTRASONIC MULTIPLEXER V1